# Altium schematic sheet Sheet2.SchDoc
size A4
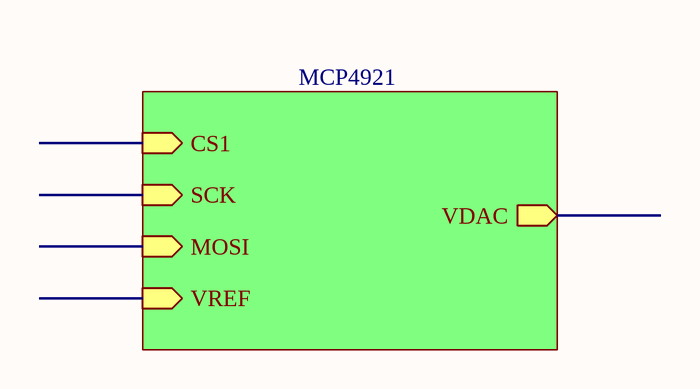
[diagram p0: Sheet2.SchDoc]

## Sub-sheets
? = MCP4921: CS1 (in), SCK (in), MOSI (in), VDAC (out), VREF (in)